# Altium schematic sheet 3V3_StepDown.SchDoc: 3V3 Step Down
size A; DrawnBy: Brent; DocumentNumber: XXXXXX; Revision: A; SheetNumber: 8; SheetTotal: 8
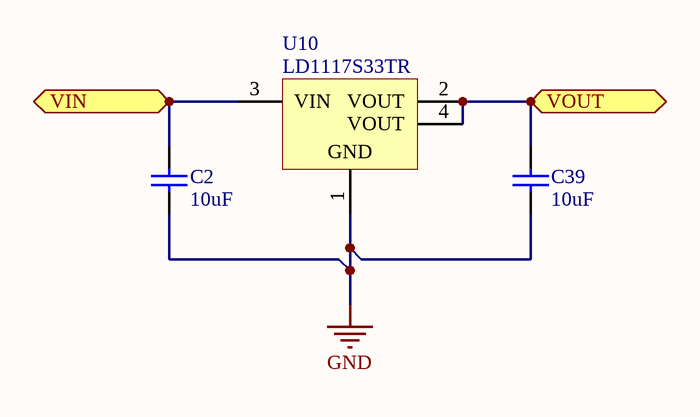
[diagram p0: 3V3_StepDown.SchDoc]

## Parts
C2  10uF  [CAPC0603(1608)100_L]
C39  10uF  [CAPC0603(1608)100_L]
U10  LD1117S33TR  [SOT-223_L]

## Ports
VIN, VOUT

## Nets
GND: C2.1 C39.1 U10.1(GND)
VIN: C2.2 U10.3(VIN) ; port VIN
VOUT: C39.2 U10.2(VOUT) U10.4(VOUT) ; port VOUT

## Library data of the parts
C2 C39 = CMP-1035-02797-1: CAP 10uF 6.3V ±20% 0603 (1608 Metric) Thickness 1mm SMD; Case-Metric: 1608; Case-EIA: 0603; Tolerance: Â±20%; Value: 10uF; Technology: SMT; Max Thickness: 1 mm; Rated Voltage: 6.3 V
U10 = CMP-0244-00310-1: Fixed Low Drop Positive Voltage Regulator, 3.3V, 4-Pin SOT-223, Tape and Reel; ComponentLink2Description: Datasheet; PackageDescription: 4-Pin SOT-223 Package, 6.5 x 3.5 mm Body, 2.3 mm Pitch, 7 mm Lead Span; PackageVersion: 2010; ComponentLink2URL: http://www.st.com/internet/com/TECHNICAL_RESOURCES/TECHNICAL_LITERATURE/DATASHEET/CD00000544.pdf; PackageReference: SOT-223; DatasheetVersion: 1/11/2011; ComponentLink1Description: Manufacturer URL; ComponentLink1URL: http://www.st.com